# Altium schematic sheet 07_MSM8916_GPIO.SchDoc
size A0
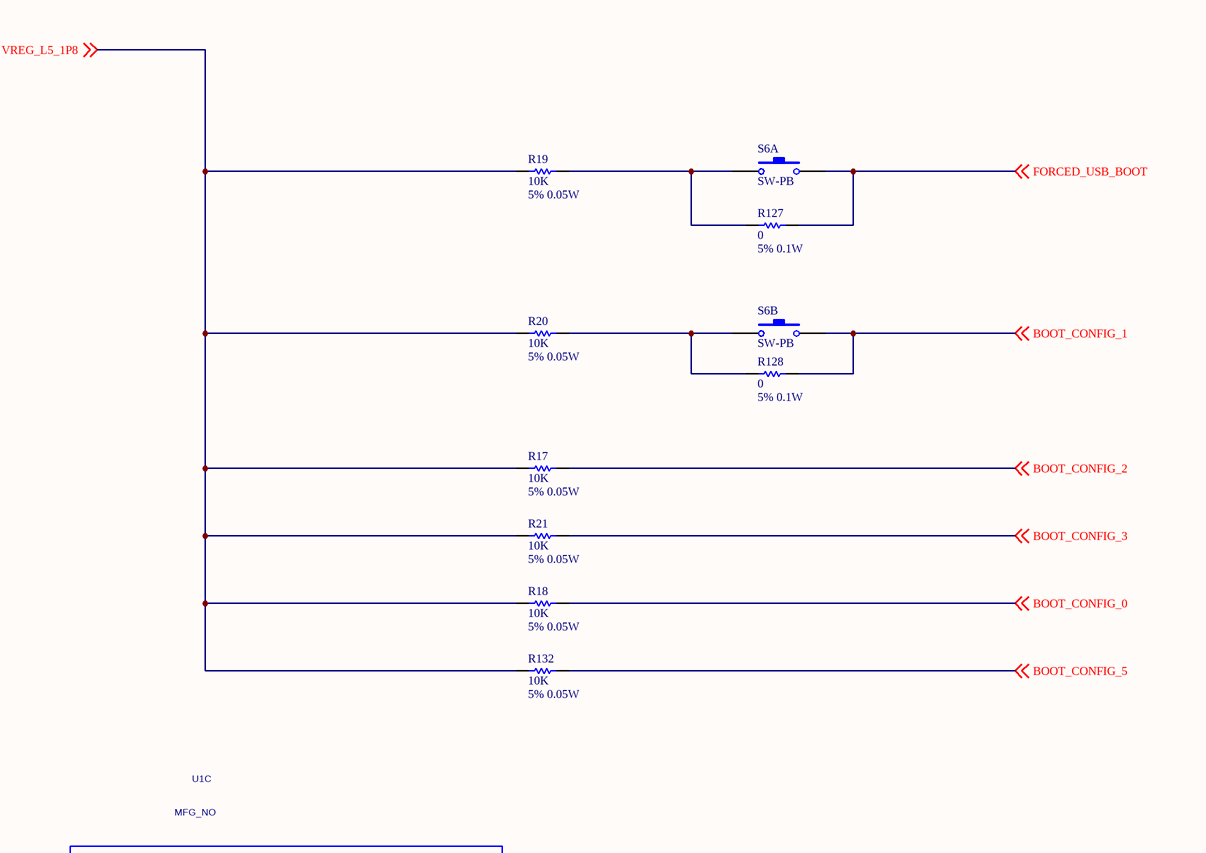
[diagram p0: 07_MSM8916_GPIO.SchDoc, top left]
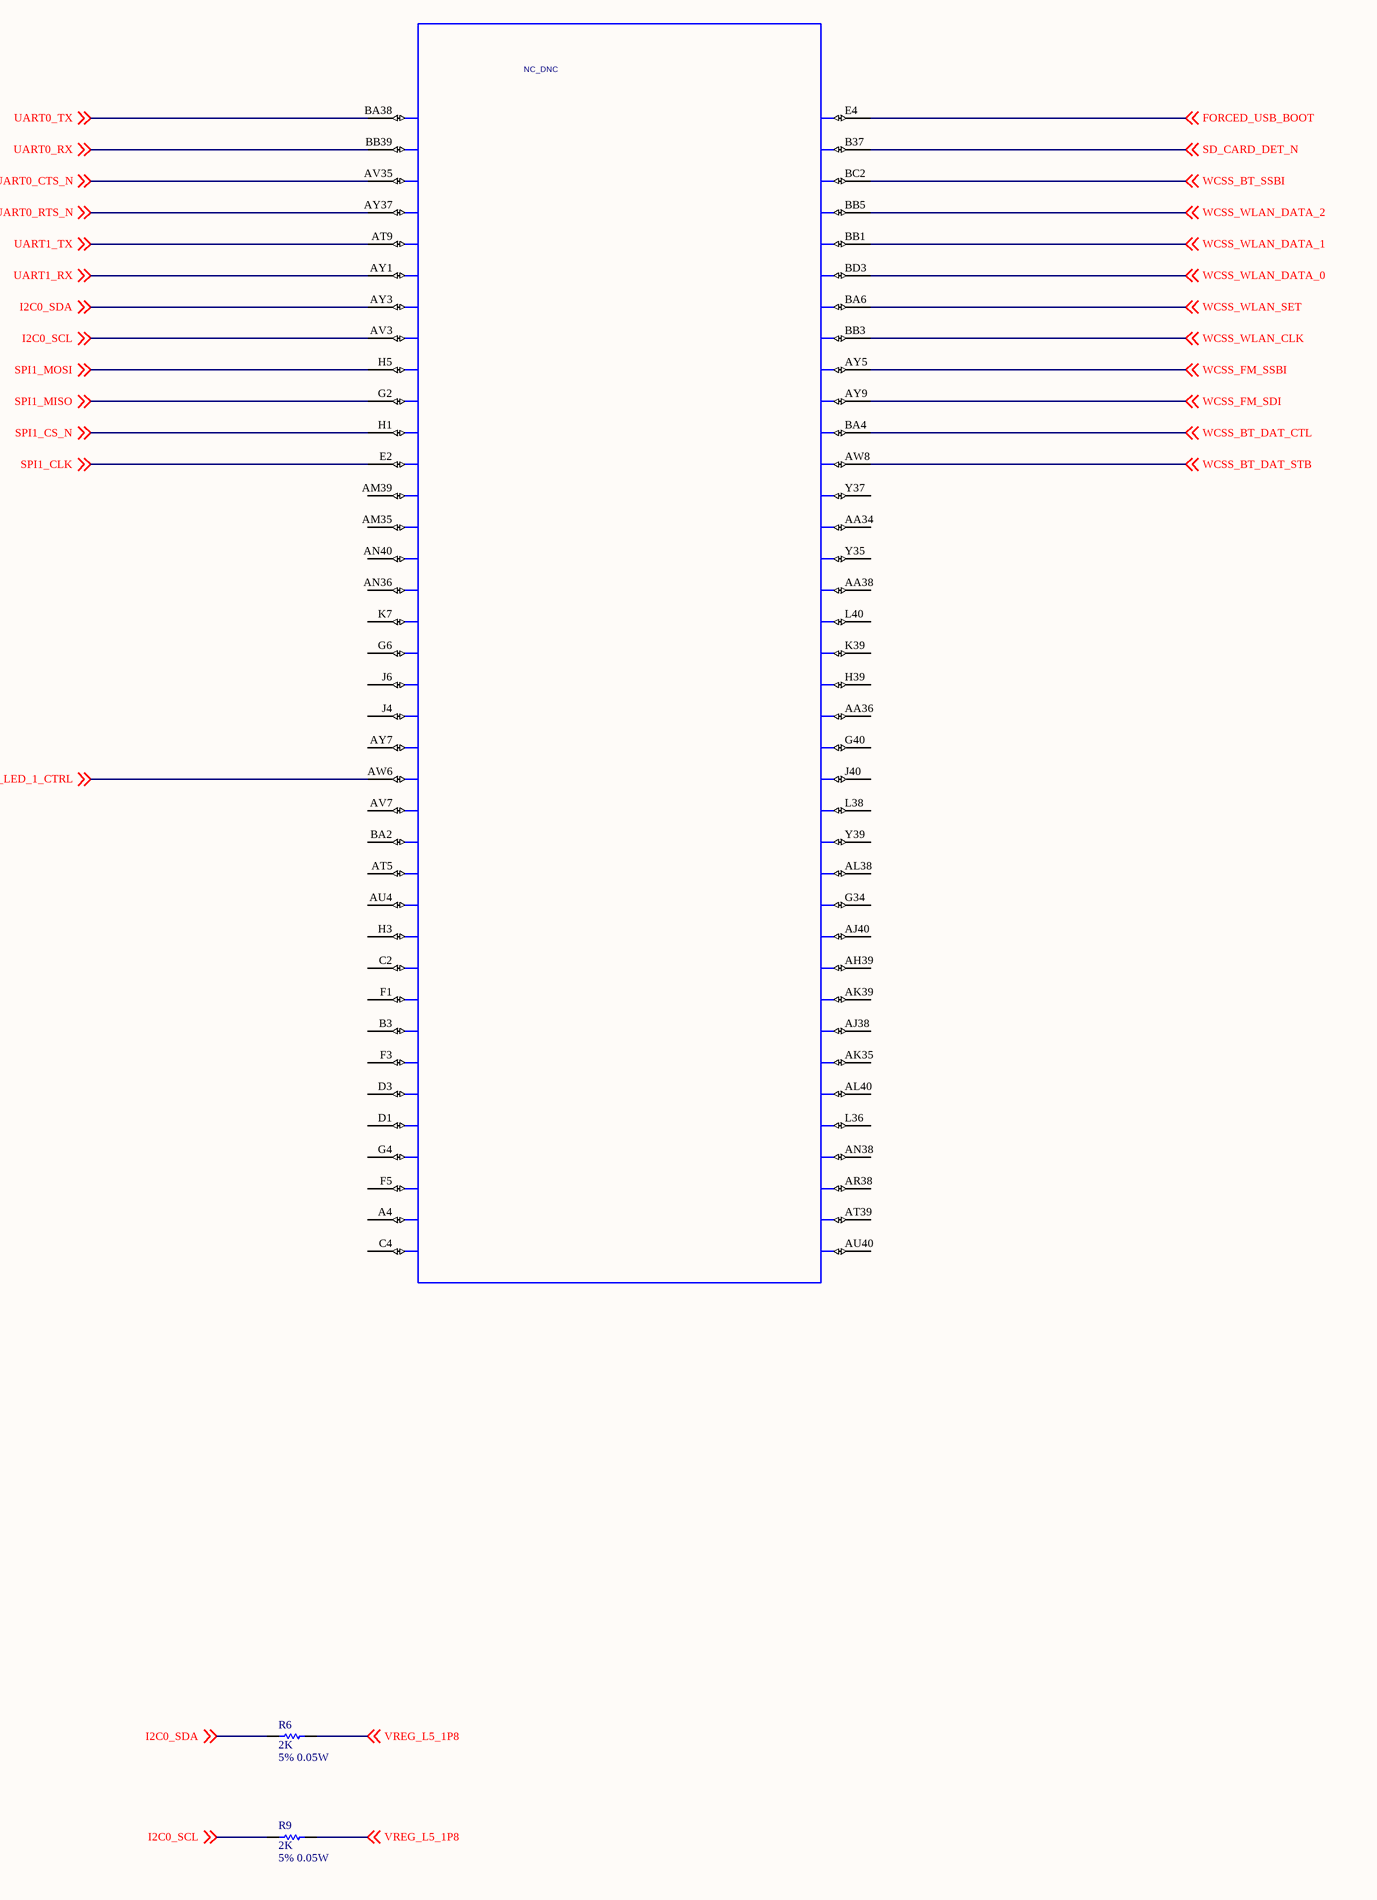
[diagram p1: 07_MSM8916_GPIO.SchDoc, bottom left]
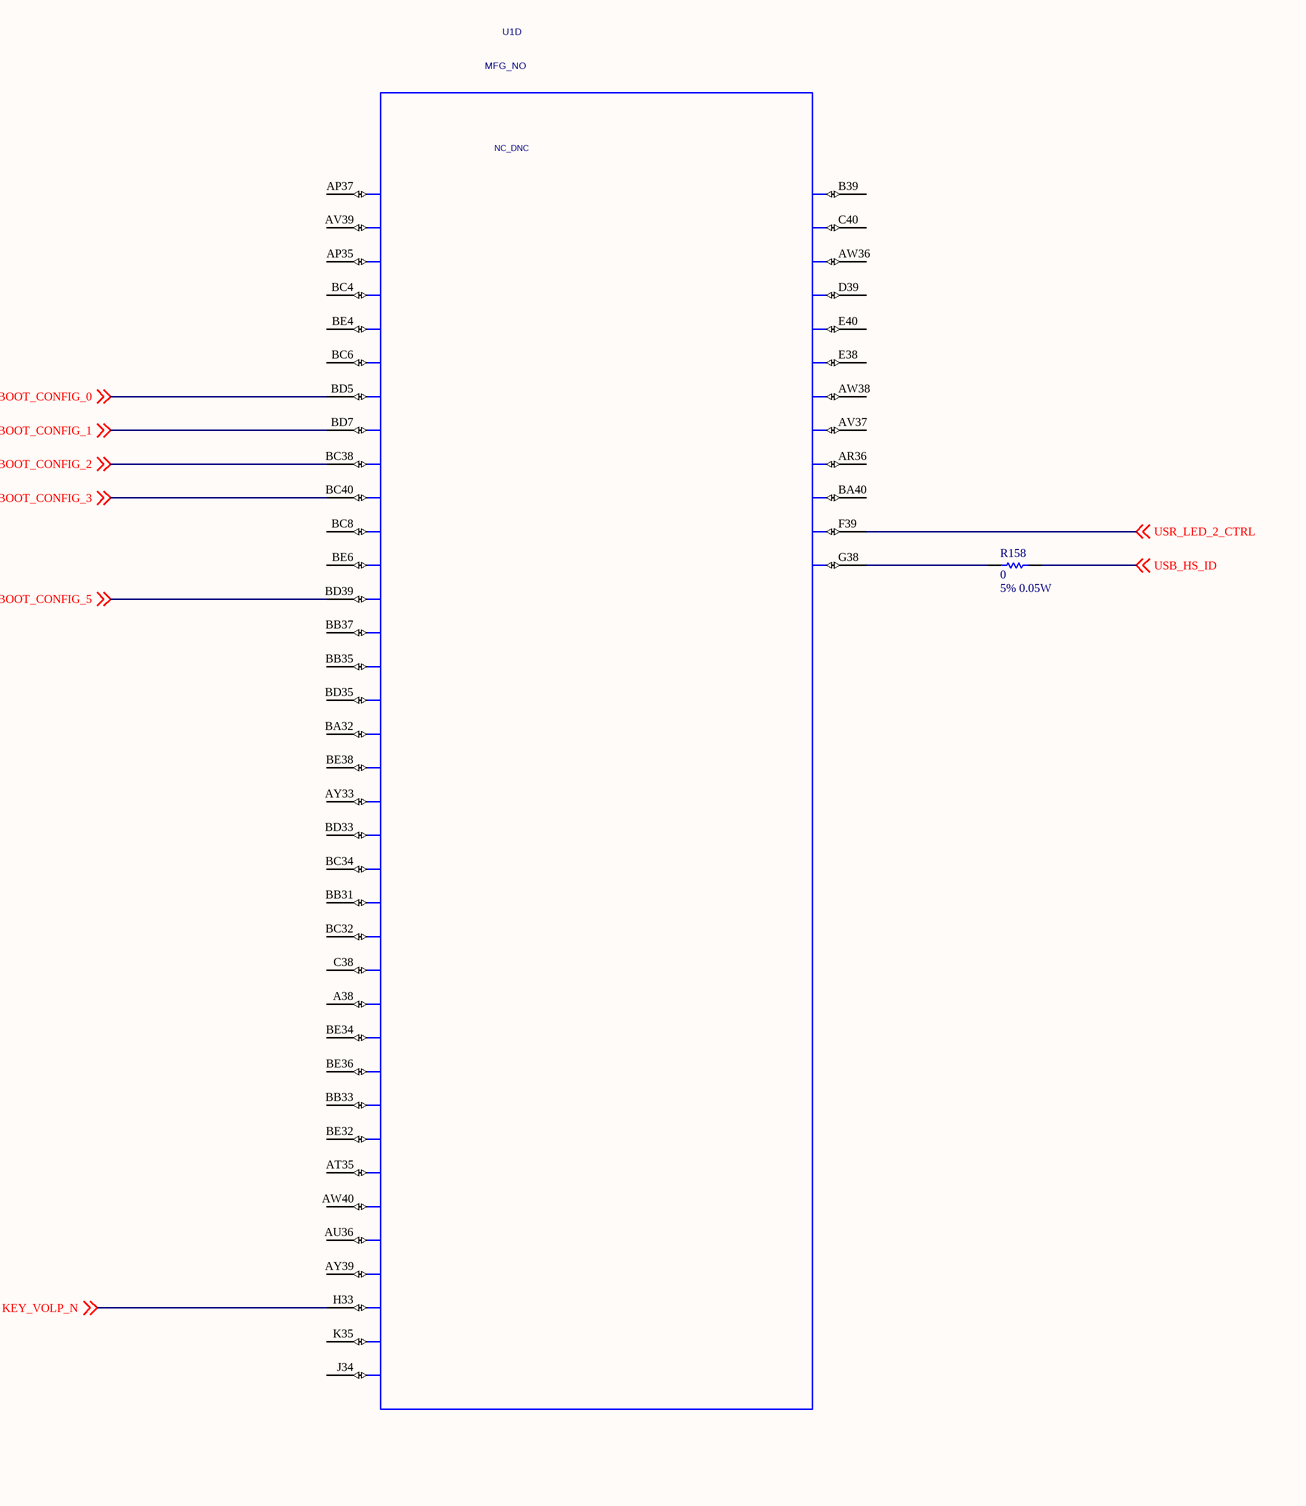
[diagram p2: 07_MSM8916_GPIO.SchDoc, bottom right]

## Parts
R6  2K  value 5% 0.05W  [AXIAL-0.3]
R9  2K  value 5% 0.05W  [AXIAL-0.3]
R17  10K  value 5% 0.05W  [AXIAL-0.3]
R18  10K  value 5% 0.05W  [AXIAL-0.3]
R19  10K  value 5% 0.05W  [AXIAL-0.3]
R20  10K  value 5% 0.05W  [AXIAL-0.3]
R21  10K  value 5% 0.05W  [AXIAL-0.3]
R127  0  value 5% 0.1W  [AXIAL-0.3]
R128  0  value 5% 0.1W  [AXIAL-0.3]
R132  10K  value 5% 0.05W  [AXIAL-0.3]
R158  0  value 5% 0.05W  [AXIAL-0.3]
S6A  SW-PB  [SPST-2]
S6B  SW-PB  [SPST-2]
U1  SYMNAME: NC_DNC  PART_ID: MFG_NO  [MSM-8916-0-760NSP-TR-00-0]  (hidden comment: ASIC_MSM8936_760PIN)  (parts C,D of 13)

## Nets
BOOT_CONFIG_0: R18.2 U1.BD5(GPIO_80) ; off-sheet BOOT_CONFIG_0
BOOT_CONFIG_1: R128.2 S6B.2 U1.BD7(GPIO_81) ; off-sheet BOOT_CONFIG_1
BOOT_CONFIG_2: R17.2 U1.BC38(GPIO_82) ; off-sheet BOOT_CONFIG_2
BOOT_CONFIG_3: R21.2 U1.BC40(GPIO_83) ; off-sheet BOOT_CONFIG_3
BOOT_CONFIG_5: R132.2 U1.BD39(GPIO_86) ; off-sheet BOOT_CONFIG_5
FORCED_USB_BOOT: R127.2 S6A.2 U1.E4(GPIO_37) ; off-sheet FORCED_USB_BOOT
I2C0_SCL: R9.2 U1.AV3(GPIO_7) ; off-sheet I2C0_SCL
I2C0_SDA: R6.2 U1.AY3(GPIO_6) ; off-sheet I2C0_SDA
KEY_VOLP_N: U1.H33(GPIO_107) ; off-sheet KEY_VOLP_N
SD_CARD_DET_N: U1.B37(GPIO_38) ; off-sheet SD_CARD_DET_N
SPI1_CLK: U1.E2(GPIO_11) ; off-sheet SPI1_CLK
SPI1_CS_N: U1.H1(GPIO_10) ; off-sheet SPI1_CS_N
SPI1_MISO: U1.G2(GPIO_9) ; off-sheet SPI1_MISO
SPI1_MOSI: U1.H5(GPIO_8) ; off-sheet SPI1_MOSI
UART0_CTS_N: U1.AV35(GPIO_2) ; off-sheet UART0_CTS_N
UART0_RTS_N: U1.AY37(GPIO_3) ; off-sheet UART0_RTS_N
UART0_RX: U1.BB39(GPIO_1) ; off-sheet UART0_RX
UART0_TX: U1.BA38(GPIO_0) ; off-sheet UART0_TX
UART1_RX: U1.AY1(GPIO_5) ; off-sheet UART1_RX
UART1_TX: U1.AT9(GPIO_4) ; off-sheet UART1_TX
USB_HS_ID: R158.2 ; off-sheet USB_HS_ID
USR_LED_1_CTRL: U1.AW6(GPIO_21) ; off-sheet USR_LED_1_CTRL
USR_LED_2_CTRL: U1.F39(GPIO_120) ; off-sheet USR_LED_2_CTRL
VREG_L5_1P8: R6.1 R9.1 R17.1 R18.1 R19.1 R20.1 R21.1 R132.1 ; off-sheet VREG_L5_1P8
WCSS_BT_DAT_CTL: U1.BA4(GPIO_47) ; off-sheet WCSS_BT_DAT_CTL
WCSS_BT_DAT_STB: U1.AW8(GPIO_48) ; off-sheet WCSS_BT_DAT_STB
WCSS_BT_SSBI: U1.BC2(GPIO_39) ; off-sheet WCSS_BT_SSBI
WCSS_FM_SDI: U1.AY9(GPIO_46) ; off-sheet WCSS_FM_SDI
WCSS_FM_SSBI: U1.AY5(GPIO_45) ; off-sheet WCSS_FM_SSBI
WCSS_WLAN_CLK: U1.BB3(GPIO_44) ; off-sheet WCSS_WLAN_CLK
WCSS_WLAN_DATA_0: U1.BD3(GPIO_42) ; off-sheet WCSS_WLAN_DATA_0
WCSS_WLAN_DATA_1: U1.BB1(GPIO_41) ; off-sheet WCSS_WLAN_DATA_1
WCSS_WLAN_DATA_2: U1.BB5(GPIO_40) ; off-sheet WCSS_WLAN_DATA_2
WCSS_WLAN_SET: U1.BA6(GPIO_43) ; off-sheet WCSS_WLAN_SET
NetR19_2: R19.2 R127.1 S6A.1
NetR20_2: R20.2 R128.1 S6B.1
NetR158_1: R158.1 U1.G38(GPIO_121)

Not connected (* = marked no-connect by the designer): U1 A4(GPIO_35) A38(GPIO_98) AA34(GPIO_50) AA36(GPIO_56) AA38(GPIO_52) AH39(GPIO_64) AJ38(GPIO_66) AJ40(GPIO_63) AK35(GPIO_67) AK39(GPIO_65) AL38(GPIO_61) AL40(GPIO_68) AM35(GPIO_13) AM39(GPIO_12) AN36(GPIO_15) AN38(GPIO_70) AN40(GPIO_14) AP35(GPIO_76) AP37(GPIO_74) AR36(GPIO_118) AR38(GPIO_71) AT5(GPIO_24) AT35(GPIO_103) AT39(GPIO_72) AU4(GPIO_25) AU36(GPIO_105) AU40(GPIO_73) AV7(GPIO_22) AV37(GPIO_117) AV39(GPIO_75) AW36(GPIO_112) AW38(GPIO_116) AW40(GPIO_104) AY7(GPIO_20) AY33(GPIO_92) AY39(GPIO_106) B3(GPIO_29) B39(GPIO_110) BA2(GPIO_23) BA32(GPIO_90) BA40(GPIO_119) BB31(GPIO_95) BB33(GPIO_101) BB35(GPIO_88) BB37(GPIO_87) BC4(GPIO_77) BC6(GPIO_79) BC8(GPIO_84) BC32(GPIO_96) BC34(GPIO_94) BD33(GPIO_93) BD35(GPIO_89) BE4(GPIO_78) BE6(GPIO_85) BE32(GPIO_102) BE34(GPIO_99) BE36(GPIO_100) BE38(GPIO_91) C2(GPIO_27) C4(GPIO_36) C38(GPIO_97) C40(GPIO_111) D1(GPIO_32) D3(GPIO_31) D39(GPIO_113) E38(GPIO_115) E40(GPIO_114) F1(GPIO_28) F3(GPIO_30) F5(GPIO_34) G4(GPIO_33) G6(GPIO_17) G34(GPIO_62) G40(GPIO_57) H3(GPIO_26) H39(GPIO_55) J4(GPIO_19) J6(GPIO_18) J34(GPIO_109) J40(GPIO_58) K7(GPIO_16) K35(GPIO_108) K39(GPIO_54) L36(GPIO_69) L38(GPIO_59) L40(GPIO_53) Y35(GPIO_51) Y37(GPIO_49) Y39(GPIO_60)

## Library data of the parts
R6 R9 R17-R21 R127 R128 R132 R158 = Res1: Resistor; Published: 8-Jun-2000; LatestRevisionDate: 17-Jul-2002; LatestRevisionNote: Re-released for DXP Platform.; PackageReference: AXIAL-0.3; Publisher: Altium Limited; PackageDescription: Axial Device, Thru-Hole; 2 Leads; 0.3 in Pin Spacing
S6A S6B = SW-PB: Switch; Published: 24-Mar-1999; LatestRevisionDate: 17-Jul-2002; LatestRevisionNote: Re-released for DXP Platform.; PackageReference: SPST-2; Publisher: Altium Limited; PackageDescription: Switch; 2 Leads
U1 = ASIC_MSM8936_760PIN: PART_NUMBER: MCN_NO; OriginalSymbolOrigin: (-1100,2500); SPLIT_INST: TRUE; CDS_LMAN_SYM_OUTLINE: -1050,2500,1050,-2500; CDS_LMAN_SPLIT_NUMBER: 1 of 13; PACK_TYPE: ?